# Altium schematic sheet altium_wheelcon.SchDoc
size A4
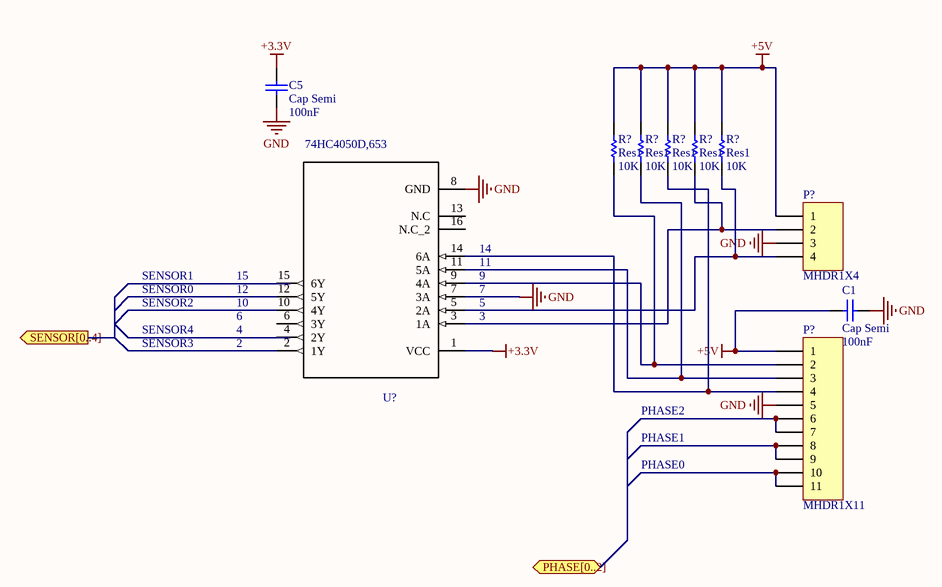
[diagram p0: altium_wheelcon.SchDoc]

## Parts
(Parts that share a designator on the sheet are numbered #1, #2 ... from top to bottom, then left to right.)
C1  Cap Semi  value 100nF  [C1206]
C5  Cap Semi  value 100nF  [C1206]
P?#1  MHDR1X4  [MHDR1X4]
P?#2  MHDR1X11  [MHDR1X11]
R?#1  Res1  value 10K  [AXIAL-0.3]
R?#2  Res1  value 10K  [AXIAL-0.3]
R?#3  Res1  value 10K  [AXIAL-0.3]
R?#4  Res1  value 10K  [AXIAL-0.3]
R?#5  Res1  value 10K  [AXIAL-0.3]
U?  74HC4050D,653  [SOIC127P600X175-16N]

## Ports
PHASE[0..2], SENSOR[0..4] (out)

## Nets
+3.3V: C5.2 U?.1(VCC)
+5V: C1.1 P?#1.1 P?#2.1 R?#1.2 R?#2.2 R?#3.2 R?#4.2 R?#5.2
GND: C1.2 C5.1 P?#1.3 P?#2.5 U?.7(3A) U?.8(GND)
NetP?#1_2: P?#1.2 R?#4.1 U?.3(1A)
NetP?#1_4: P?#1.4 R?#5.1 U?.5(2A)
NetP?#2_2: P?#2.2 R?#1.1 U?.9(4A)
NetP?#2_3: P?#2.3 R?#2.1 U?.11(5A)
NetP?#2_4: P?#2.4 R?#3.1 U?.14(6A)
NetP?#2_6: P?#2.6 P?#2.7
NetP?#2_8: P?#2.8 P?#2.9
NetP?#2_10: P?#2.10 P?#2.11
NetU?_4: U?.4(2Y) U?.10(4Y)

Not connected (* = marked no-connect by the designer): U? 2(1Y) 6(3Y) 12(5Y) 13(N.C) 15(6Y) 16(N.C_2)

## Notes on the sheet
- SENSOR1
- SENSOR0
- 15
- 12
- (near U?) 14
- (near U?) 11
- (near U?) 9
- (near U?) 7
- SENSOR2
- SENSOR4
- SENSOR3
- 6
- 4
- 2
- 10
- (near U?) 5
- (near U?) 3
- PHASE2
- PHASE1
- PHASE0

## Library data of the parts
C1 C5 = Cap Semi: Capacitor (Semiconductor SIM Model); Published: 8-Jun-2000; LatestRevisionDate: 29-May-2009; LatestRevisionNote: IPC-7351 Footprint Added.; PackageReference: C1206; Publisher: Altium Limited; PackageDescription: Chip Capacitor
P?#1 = MHDR1X4: Header, 4-Pin; LatestRevisionDate: 17-Jul-2002; LatestRevisionNote: Re-released for DXP Platform.; Publisher: Altium Limited
P?#2 = MHDR1X11: Header, 11-Pin; LatestRevisionDate: 17-Jul-2002; LatestRevisionNote: Re-released for DXP Platform.; Publisher: Altium Limited
R?#1-R?#5 = Res1: Resistor; Published: 8-Jun-2000; LatestRevisionDate: 17-Jul-2002; LatestRevisionNote: Re-released for DXP Platform.; PackageReference: AXIAL-0.3; Publisher: Altium Limited; PackageDescription: Axial Device, Thru-Hole; 2 Leads; 0.3 in Pin Spacing
U? = 74HC4050D,653: IC HEX LEVEL SHIFTER 16SOIC; MF: Nexperia; Availability: Good; MP: 74HC4050D,653; Price: 0.23 USD; Package: SO-16 Nexperia; Value: *